# Altium schematic sheet POWER.SchDoc
size A4
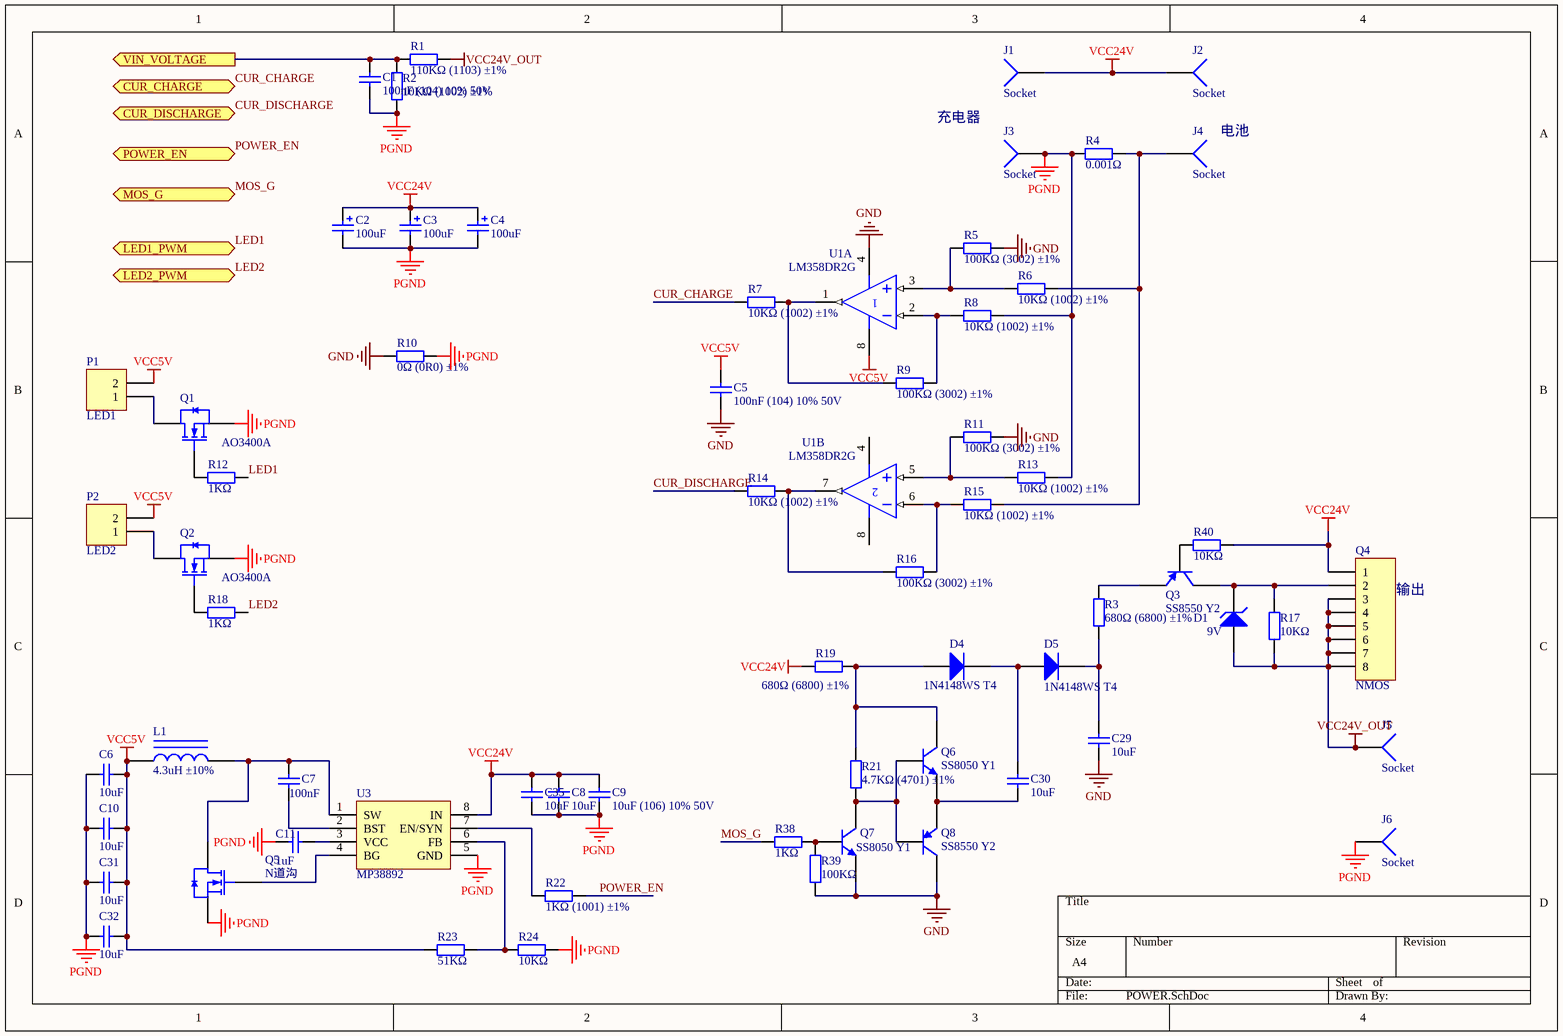
[diagram p0: POWER.SchDoc]

## Parts
C1  100nF (104) 10% 50V  [0603_C]
C2  100uF  [CC6.56.5]
C3  100uF  [CC6.56.5]
C4  100uF  [CC6.56.5]
C5  100nF (104) 10% 50V  [0603_C]
C6  10uF  [1206_C]
C7  100nF  [0603_C]
C8  10uF  [1206_C]
C9  10uF (106) 10% 50V  [1206_C]
C10  10uF  [1206_C]
C11  1uF  [0603_C]
C29  10uF  [0805_C]
C30  10uF  [0805_C]
C31  10uF  [1206_C]
C32  10uF  [1206_C]
C35  10uF  [1206_C]
D1  9V  [LL-34]
D4  1N4148WS T4  [SOD-323]
D5  1N4148WS T4  [SOD-323]
J1  Socket  [PIN1]
J2  Socket  [PIN1]
J3  Socket  [PIN1]
J4  Socket  [PIN1]
J5  Socket  [PIN1]
J6  Socket  [PIN1]
L1  4.3uH ±10%  [2225]
P1  LED1  [HDR1X2]
P2  LED2  [HDR1X2]
Q1  AO3400A  [SOT-23-3L]
Q2  AO3400A  [SOT-23-3L]
Q3  SS8550 Y2  [SOT-23(SOT-23-3)]
Q4  NMOS  [TO-263-7]
Q5  N道沟  [TO-252-2]
Q6  SS8050 Y1  [SOT-23(SOT-23-3)]
Q7  SS8050 Y1  [SOT-23(SOT-23-3)]
Q8  SS8550 Y2  [SOT-23(SOT-23-3)]
R1  110KΩ (1103) ±1%  [0603_R]
R2  10KΩ (1002) ±1%  [0603_R]
R3  680Ω (6800) ±1%  [0603_R]
R4  0.001Ω  [2512_R]
R5  100KΩ (3002) ±1%  [0603_R]
R6  10KΩ (1002) ±1%  [0603_R]
R7  10KΩ (1002) ±1%  [0603_R]
R8  10KΩ (1002) ±1%  [0603_R]
R9  100KΩ (3002) ±1%  [0603_R]
R10  0Ω (0R0) ±1%  [0603_R]
R11  100KΩ (3002) ±1%  [0603_R]
R12  1KΩ  [0603_R]
R13  10KΩ (1002) ±1%  [0603_R]
R14  10KΩ (1002) ±1%  [0603_R]
R15  10KΩ (1002) ±1%  [0603_R]
R16  100KΩ (3002) ±1%  [0603_R]
R17  10KΩ  [0603_R]
R18  1KΩ  [0603_R]
R19  680Ω (6800) ±1%  [0603_R]
R21  4.7KΩ (4701) ±1%  [0603_R]
R22  1KΩ (1001) ±1%  [0603_R]
R23  51KΩ  [0603_R]
R24  10KΩ  [0603_R]
R38  1KΩ  [0603_R]
R39  100KΩ  [0603_R]
R40  10KΩ  [0603_R]
U1  LM358DR2G  [SOIC-8_150mil]  (parts A,B of 2)
U3  MP38892  [SOIC-8_EP_150mil]

## Ports
CUR_CHARGE (out), CUR_DISCHARGE (out), LED1_PWM (in), LED2_PWM (in), MOS_G (in), POWER_EN (in), VIN_VOLTAGE (out)

## Nets
GND: C5.2 C29.1 Q7.2(E) Q8.3(C) R5.1 R10.1 R11.1 R39.1 U1.4(V-)
PGND: C1.2 C2.2 C3.2 C4.2 C6.2 C8.1 C9.1 C10.2 C11.2 C31.2 C32.2 C35.2 J3.1 J6.1 Q1.2(S) Q2.2(S) Q5.2(S) R2.1 R4.2 R8.2 R10.2 R13.2 R24.1 U3.5(GND)
VCC5V: C5.1 C6.1 C10.1 C31.1 C32.1 L1.1 P1.2 P2.2 R23.2 U1.8(V+)
VCC24V: C2.1 C3.1 C4.1 C8.2 C9.2 C35.1 J1.1 J2.1 Q4.1 R19.2 R40.1 U3.8(IN)
VCC24V_OUT: D1.1(A) J5.1 Q4.3 Q4.4 Q4.5 Q4.6 Q4.7 Q4.8 R1.1 R17.1
CUR_CHARGE: R7.1 ; port CUR_CHARGE
CUR_DISCHARGE: R14.1 ; port CUR_DISCHARGE
LED1: R12.1 ; port LED1_PWM
LED2: R18.1 ; port LED2_PWM
MOS_G: R38.1 ; port MOS_G
POWER_EN: R22.2 ; port POWER_EN
VIN_VOLTAGE: C1.1 R1.2 R2.2 ; port VIN_VOLTAGE
NetC7_1: C7.1 U3.2(BST)
NetC7_2: C7.2 L1.2 Q5.3(D) U3.1(SW)
NetC11_1: C11.1 U3.3(VCC)
NetC29_2: C29.2 D5.2(K) R3.2
NetC30_1: C30.1 Q6.2(E) Q8.2(E)
NetC30_2: C30.2 D4.2(K) D5.1(A)
NetD1_2: D1.2(K) Q3.3(C) Q4.2 R17.2
NetD4_1: D4.1(A) Q6.3(C) R19.1 R21.2
NetJ4_1: J4.1 R4.1 R6.2 R15.2
NetP1_1: P1.1 Q1.3(D)
NetP2_1: P2.1 Q2.3(D)
NetQ1_1: Q1.1(G) R12.2
NetQ2_1: Q2.1(G) R18.2
NetQ3_1: Q3.1(B) R40.2
NetQ3_2: Q3.2(E) R3.1
NetQ5_1: Q5.1(G) U3.4(BG)
NetQ6_1: Q6.1(B) Q7.3(C) Q8.1(B) R21.1
NetQ7_1: Q7.1(B) R38.2 R39.2
NetR5_2: R5.2 R6.1 U1.3(IN+)
NetR7_2: R7.2 R9.1 U1.1(OUT)
NetR8_1: R8.1 R9.2 U1.2(IN-)
NetR11_2: R11.2 R13.1 U1.5(IN+)
NetR14_2: R14.2 R16.1 U1.7(OUT)
NetR15_1: R15.1 R16.2 U1.6(IN-)
NetR22_1: R22.1 U3.7(EN/SYN)
NetR23_1: R23.1 R24.2 U3.6(FB)

## Notes on the sheet
- 充电器
- (near J4) 电池
- (near Q4) 输出

## Library data of the parts
C1 C5 C7 = 0603 100nF (104) 10% 50V: 贴片电容; ComponentLink1Description: 供应商链接; ComponentLink1URL: http://www.szlcsc.com/product/details_15331.html; Package: 0603; Supplier: LC; SuppliersPartNumber: C14663
C2-C4 = 3528 100uF (107) 10% 6.3V: 钽电容; ComponentLink1Description: 供应商链接; ComponentLink1URL: http://www.szlcsc.com/product/details_16815.html; Package: 3528; Supplier: LC; SuppliersPartNumber: C16133
C6 C8-C10 C31 C32 C35 = 1206 10uF (106) 10% 50V: 贴片电容; ComponentLink1Description: 供应商链接; ComponentLink1URL: http://www.szlcsc.com/product/details_14236.html; Package: 1206; Supplier: LC; SuppliersPartNumber: C13585
C11 = 0603 1uF (105) 10% 50V: 贴片电容; ComponentLink1Description: 供应商链接; ComponentLink1URL: http://www.szlcsc.com/product/details_16531.html; Package: 0603; Supplier: LC; SuppliersPartNumber: C15849
C29 C30 = 0805 10uF (106) 10% 25V: 贴片电容; ComponentLink1Description: 供应商链接; ComponentLink1URL: http://www.szlcsc.com/product/details_16532.html; Package: 0805; Supplier: LC; SuppliersPartNumber: C15850
D1 = LL-34 ZMM5V6: 稳压二极管; ComponentLink1Description: 供应商链接; ComponentLink1URL: http://www.szlcsc.com/product/details_8541.html; Package: LL-34; Supplier: LC; SuppliersPartNumber: C8062
D4 D5 = SOD-323 1N4148WS T4: 二极管; ComponentLink1Description: 供应商链接; ComponentLink1URL: http://www.szlcsc.com/product/details_2485.html; Package: SOD-323; Supplier: LC; SuppliersPartNumber: C2128
L1 = 0805 10uH 10%: 贴片电感; ComponentLink1Description: 供应商链接; ComponentLink1URL: http://www.szlcsc.com/product/details_1398.html; Package: 0805; Supplier: LC; SuppliersPartNumber: C1046
P1 P2 = Header 2: Header, 2-Pin; LatestRevisionDate: 17-Jul-2002; LatestRevisionNote: Re-released for DXP Platform.; Publisher: Altium Limited
Q1 Q2 = AO3400A N道沟 X0YV1T SOT-23: MOS(场效应管); ComponentLink1Description: 供应商链接; ComponentLink1URL: http://www.szlcsc.com/product/details_21629.html; Package: SOT-23; Supplier: LC; SuppliersPartNumber: C20917
Q3 Q8 = SOT-23 SS8550 Y2: 三极管; ComponentLink1Description: 供应商链接; ComponentLink1URL: http://www.szlcsc.com/product/details_9037.html; Package: SOT-23; Supplier: LC; SuppliersPartNumber: C8542
Q4 = Header 8: Header, 8-Pin; pin to pad: 1>0 2>1 3>2 4>3 5>4 6>5 7>6 8>7; LatestRevisionDate: 17-Jul-2002; LatestRevisionNote: Re-released for DXP Platform.; Publisher: Altium Limited
Q5 = AO3400A N道沟 X0YV1T SOT-23: MOS(场效应管); pin to pad: 2>3 3>2; ComponentLink1Description: 供应商链接; ComponentLink1URL: http://www.szlcsc.com/product/details_21629.html; Package: SOT-23; Supplier: LC; SuppliersPartNumber: C20917
Q6 Q7 = SOT-23 SS8050 Y1: 三极管; ComponentLink1Description: 供应商链接; ComponentLink1URL: http://www.szlcsc.com/product/details_2507.html; Package: SOT-23; Supplier: LC; SuppliersPartNumber: C2150
R1 = 0603 110KΩ (1103) 1%: 贴片电阻; ComponentLink1Description: 供应商链接; ComponentLink1URL: http://www.szlcsc.com/product/details_26548.html; Package: 0603; Supplier: LC; SuppliersPartNumber: C25805
R2 R6-R8 R13-R15 R17 R24 R40 = 0603 10KΩ (1002) 1%: 贴片电阻; ComponentLink1Description: 供应商链接; ComponentLink1URL: http://www.szlcsc.com/product/details_26547.html; Package: 0603; Supplier: LC; SuppliersPartNumber: C25804
R3 R19 = 0603 680Ω (6800) 1%: 贴片电阻; ComponentLink1Description: 供应商链接; ComponentLink1URL: http://www.szlcsc.com/product/details_23955.html; Package: 0603; Supplier: LC; SuppliersPartNumber: C23228
R4 R10 = 0603 0Ω (0R0) 1%: 贴片电阻; ComponentLink1Description: 供应商链接; ComponentLink1URL: http://www.szlcsc.com/product/details_21903.html; Package: 0603; Supplier: LC; SuppliersPartNumber: C21189
R5 R9 R11 R16 R39 = 0603 30KΩ (3002) 1%: 贴片电阻; ComponentLink1Description: 供应商链接; ComponentLink1URL: http://www.szlcsc.com/product/details_23711.html; Package: 0603; Supplier: LC; SuppliersPartNumber: C22984
R12 R18 R22 R38 = 0603 1KΩ (1001) 1%: 贴片电阻; ComponentLink1Description: 供应商链接; ComponentLink1URL: http://www.szlcsc.com/product/details_21904.html; Package: 0603; Supplier: LC; SuppliersPartNumber: C21190
R21 = 0603 4.7KΩ (4701) 1%: 贴片电阻; ComponentLink1Description: 供应商链接; ComponentLink1URL: http://www.szlcsc.com/product/details_23889.html; Package: 0603; Supplier: LC; SuppliersPartNumber: C23162
R23 = 0603 51KΩ (5102) 1%: 贴片电阻; ComponentLink1Description: 供应商链接; ComponentLink1URL: http://www.szlcsc.com/product/details_23923.html; Package: 0603; Supplier: LC; SuppliersPartNumber: C23196
U1 = LM358DR2G: 通用运放; ComponentLink1Description: 供应商链接; ComponentLink1URL: http://www.szlcsc.com/product/details_8427.html; Package: SOIC-8; Supplier: LC; SuppliersPartNumber: C7950
J1-J6 = Socket: LatestRevisionDate: 17-Jul-2002; LatestRevisionNote: Re-released for DXP Platform.; Publisher: Altium Limited